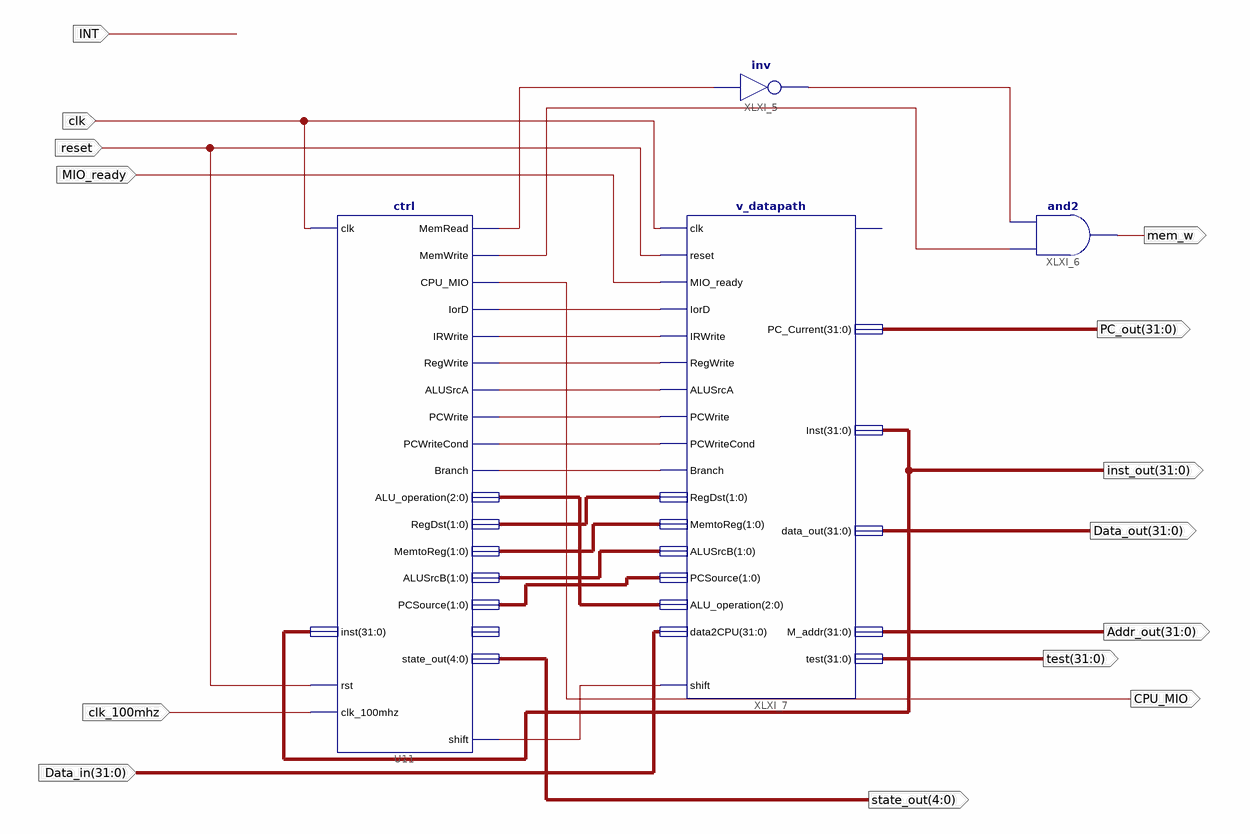
[diagram p0: schematic sheet 1]
// Xilinx ISE schematic MCPU.sch (kintex7) as structural Verilog: 4 symbols, 14 ports
module MCPU (
  input  clk,
  input  reset,
  input  MIO_ready,
  input  [31:0] Data_in,
  input  INT,
  input  clk_100mhz,
  output [31:0] inst_out,
  output CPU_MIO,
  output [31:0] Addr_out,
  output mem_w,
  output [31:0] PC_out,
  output [31:0] Data_out,
  output [4:0] state_out,
  output [31:0] test
);

  wire branch, XLXN_8, XLXN_9, XLXN_10, XLXN_11, XLXN_12, XLXN_39, XLXN_41, XLXN_42, XLXN_44, XLXN_59;
  wire [1:0] XLXN_46, XLXN_47, XLXN_48, XLXN_49;
  wire [2:0] XLXN_45;

  ctrl U11 (
    .clk(clk), .inst(inst_out), .rst(reset), .clk_100mhz(clk_100mhz), .MemRead(XLXN_39), .MemWrite(XLXN_41),
    .CPU_MIO(CPU_MIO), .IorD(XLXN_12), .IRWrite(XLXN_11), .RegWrite(XLXN_10), .ALUSrcA(XLXN_9),
    .PCWrite(XLXN_8), .PCWriteCond(XLXN_44), .Branch(branch), .ALU_operation(XLXN_45), .RegDst(XLXN_46),
    .MemtoReg(XLXN_47), .ALUSrcB(XLXN_48), .PCSource(XLXN_49), .state_out(state_out), .shift(XLXN_59));  // open: ALUop
  not XLXI_5 (XLXN_42, XLXN_39);
  and XLXI_6 (mem_w, XLXN_41, XLXN_42);
  v_datapath XLXI_7 (
    .clk(clk), .reset(reset), .MIO_ready(MIO_ready), .IorD(XLXN_12), .IRWrite(XLXN_11), .RegWrite(XLXN_10),
    .ALUSrcA(XLXN_9), .PCWrite(XLXN_8), .PCWriteCond(XLXN_44), .Branch(branch), .RegDst(XLXN_46),
    .MemtoReg(XLXN_47), .ALUSrcB(XLXN_48), .PCSource(XLXN_49), .ALU_operation(XLXN_45), .data2CPU(Data_in),
    .PC_Current(PC_out), .Inst(inst_out), .data_out(Data_out), .M_addr(Addr_out), .test(test), .shift(XLXN_59));  // open: zero
endmodule
